# Altium schematic sheet Sch2.SchDoc
size A3; SheetNumber: 1; SheetTotal: 2
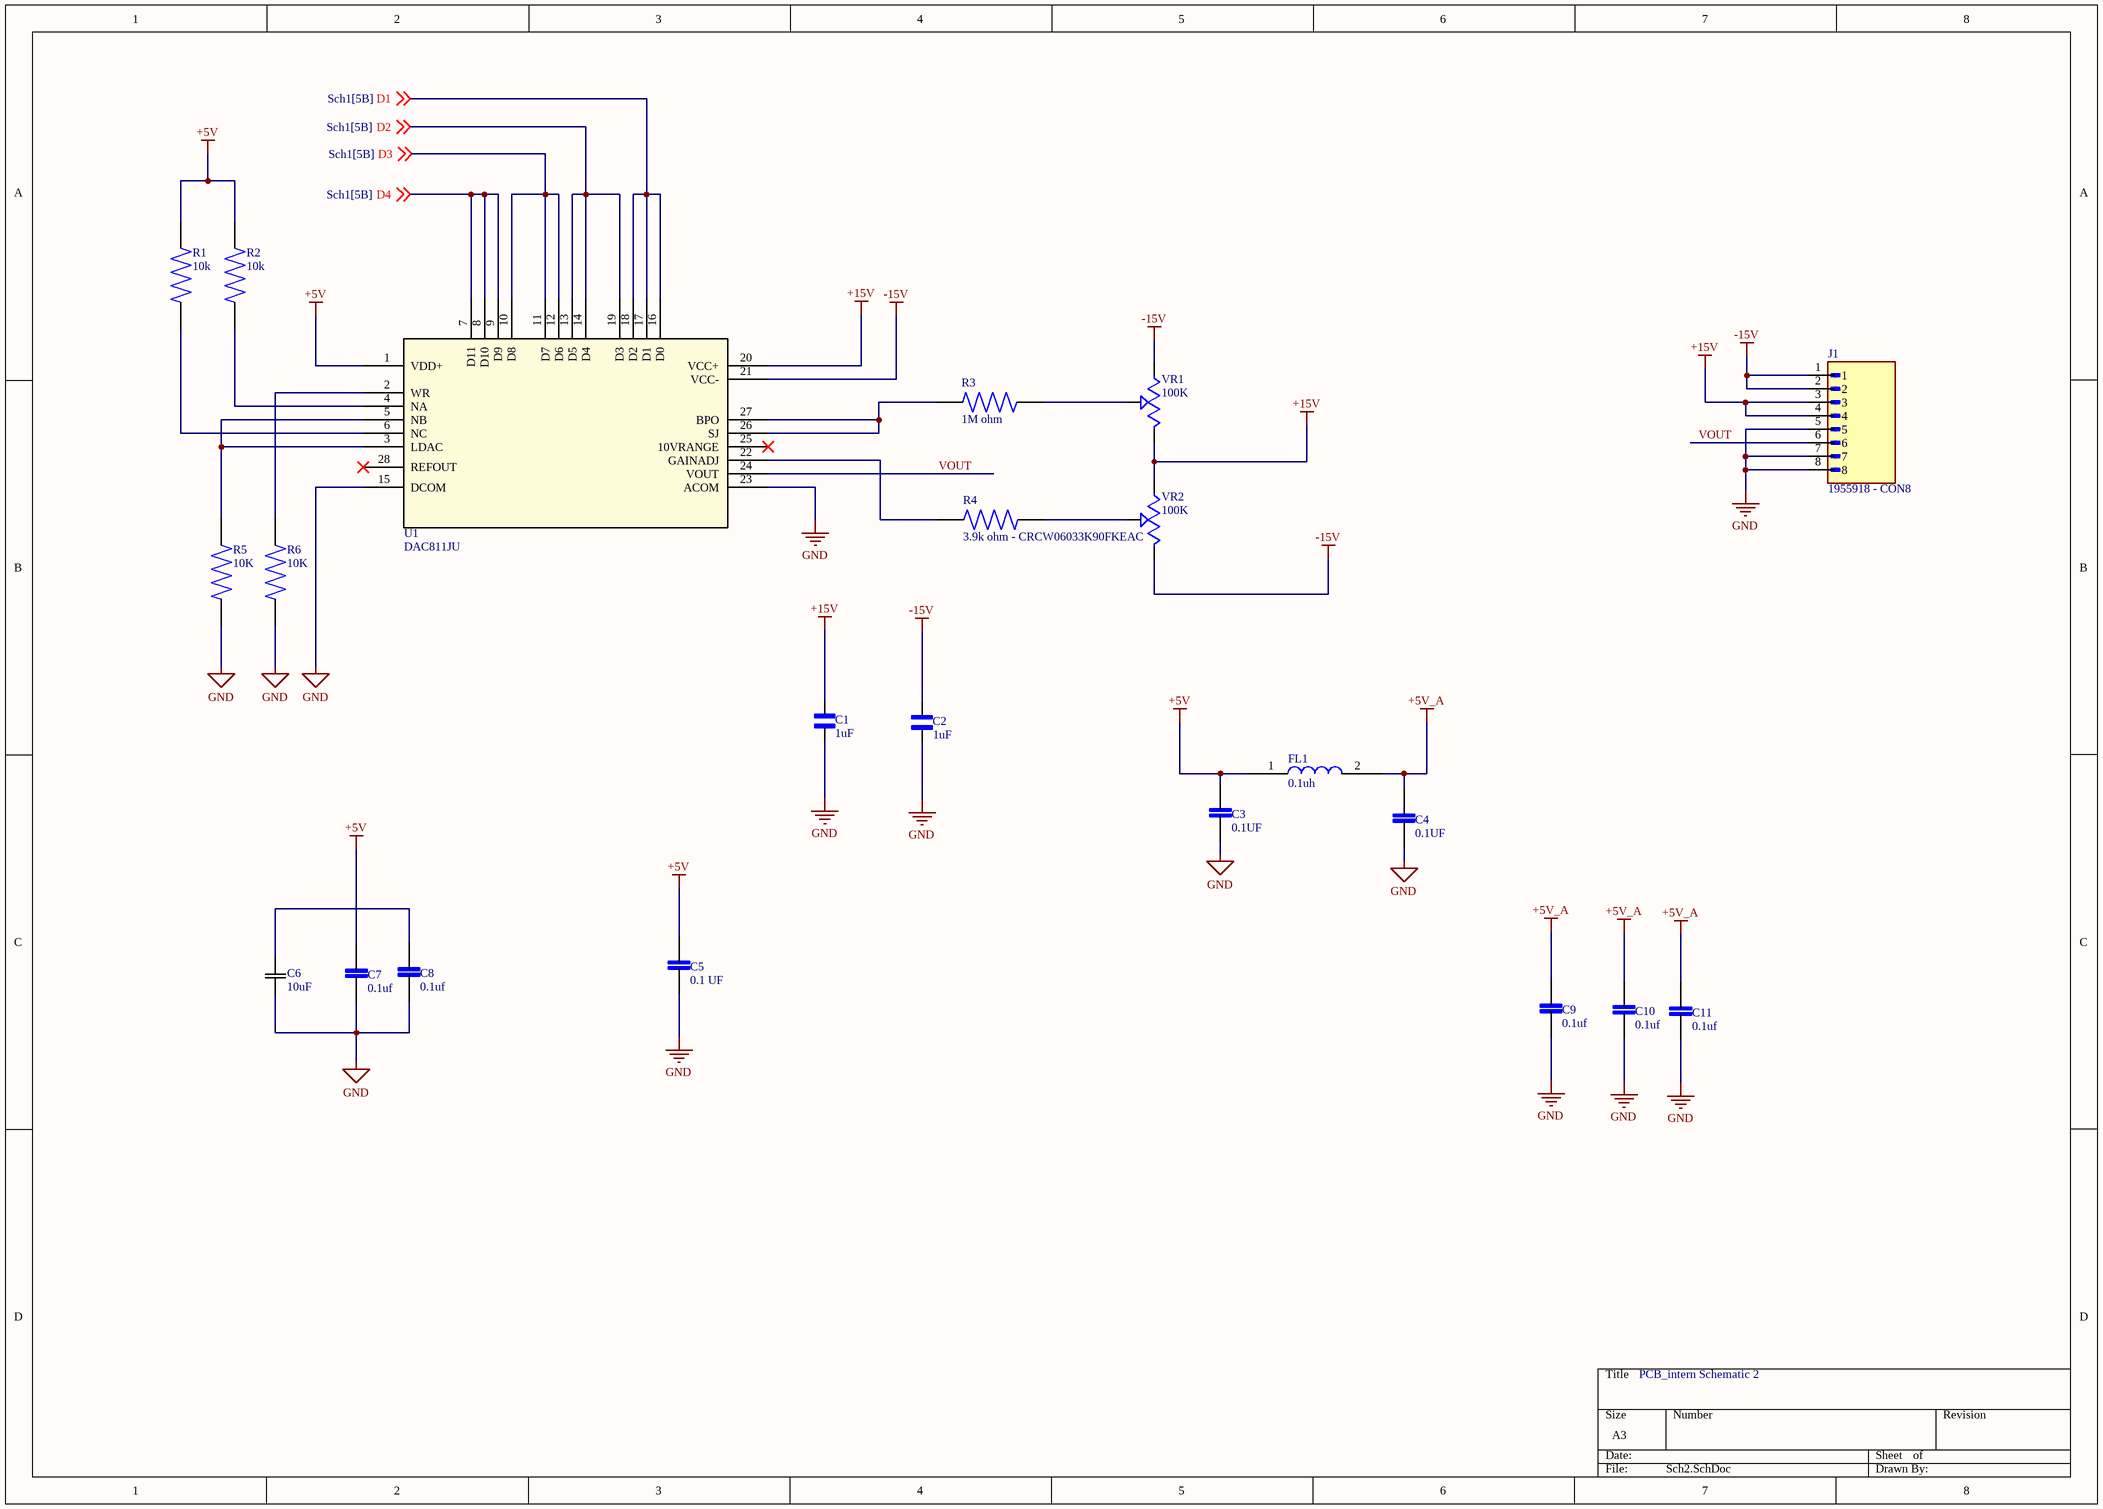
[diagram p0: Sch2.SchDoc]

## Parts
C1  1uF  [VARC3216X85N]
C2  1uF  [VARC3216X85N]
C3  0.1UF  [CAPC1608X90]
C4  0.1UF  [CAPC1608X90]
C5  0.1 UF  [CAPC1608X90]
C6  10uF  [CAP_TCJ-C-2312_KAV]
C7  0.1uf  [CAPC1608X90]
C8  0.1uf  [CAPC1608X90]
C9  0.1uf  [CAPC1608X90]
C10  0.1uf  [CAPC1608X90]
C11  0.1uf  [CAPC1608X90]
FL1  0.1uh  [BEADC1608X95N]
J1  1955918 - CON8  [PHOENIX_1955918]
R1  10k  [RESC1508X50N]
R2  10k  [RESC1508X50N]
R3  1M ohm  [RESC1508X50N]
R4  3.9k ohm - CRCW06033K90FKEAC  [RESC1608X55N]
R5  10K  [RESC1508X50N]
R6  10K  [RESC1508X50N]
U1  DAC811JU  [DW28]
VR1  100K  [TRIM_3266W-1-104LF]
VR2  100K  [TRIM_3266W-1-104LF]

## Nets
+5V: C3.2 C5.2 C7.2 FL1.1 R1.2 R2.2 U1.1(VDD+)
+5V_A: C4.2 C9.2 C10.2 C11.2 FL1.2
+15V: C1.1 J1.3 J1.4 U1.20(VCC+) VR1.3(CW) VR2.1(CCW)
-15V: C2.1 J1.1 J1.2 U1.21(VCC-) VR1.1(CCW) VR2.3(CW)
GND: C1.2 C2.2 C3.1 C4.1 C5.1 C6.1 C7.1 C8.1 C9.1 C10.1 C11.1 J1.5 J1.7 J1.8 R5.1 R6.1 U1.15(DCOM) U1.23(ACOM)
D1: U1.16(D0) U1.17(D1) U1.18(D2) ; off-sheet D1
D2: U1.13(D5) U1.14(D4) U1.19(D3) ; off-sheet D2
D3: U1.10(D8) U1.11(D7) U1.12(D6) ; off-sheet D3
D4: U1.7(D11) U1.8(D10) U1.9(D9) ; off-sheet D4
VOUT: J1.6 U1.24(VOUT)
NetC6_2: C6.2 C8.2
NetR1_1: R1.1 U1.6(NC)
NetR2_1: R2.1 U1.4(NA)
NetR3_1: R3.1 U1.26(SJ) U1.27(BPO)
NetR3_2: R3.2 VR1.2(WIPER)
NetR4_1: R4.1 U1.22(GAINADJ)
NetR4_2: R4.2 VR2.2(WIPER)
NetR5_2: R5.2 U1.3(LDAC) U1.5(NB)
NetR6_2: R6.2 U1.2(WR)

Not connected (* = marked no-connect by the designer): U1 25(10VRANGE)* 28(REFOUT)*

## Notes on the sheet
- PCB_intern Schematic 2

## Library data of the parts
C1 C2 = 1uF - C1206C104K5RACTU: Capacitor;Ceramic;Cap;.1 uF;Tol+10%;SMT;Vol-Rtg 50V;X7R;TR | KEMET C1206C104K5RACTU; SnapEDA_Link: https://www.snapeda.com/parts/C1206C104K5RACTU/KEMET/view-part/?ref=snap; Package: 1206-2 KEMET; Value: *; MF: KEMET; MP: C1206C104K5RACTU; Check_prices: https://www.snapeda.com/parts/C1206C104K5RACTU/KEMET/view-part/?ref=eda
C3-C5 C7-C11 = 0.1uf - C0603C104K5RACTU: 0.1 ÂµF Â±10% 50V Ceramic Capacitor X7R 0603 (1608 Metric); MF: KEMET; SnapEDA_Link: https://www.snapeda.com/parts/C0603C104K5RACTU/KEMET/view-part/?ref=snap; Package: 603-2 KEMET; Value: *; MP: C0603C104K5RACTU; Check_prices: https://www.snapeda.com/parts/C0603C104K5RACTU/KEMET/view-part/?ref=eda
C6 = 10UF - TCJC106M035R0200E: Description; Manufacturer_Name: KYOCERA AVX; Type: Tantalum-Polymer Capacitors; Copyright: Copyright (C) 2025 Ultra Librarian. All rights reserved.; Manufacturer_Part_Number: TCJC106M035R0200E
FL1 = 0.1uh-BLM18AG601SN1D: 0.1uHz 1 - Ferrite Bead 0603 (1608 Metric) 500mA 380mOhm; MF: Murata; Check_prices: https://www.snapeda.com/parts/BLM18AG601SN1D/Murata/view-part/?ref=eda; SnapEDA_Link: https://www.snapeda.com/parts/BLM18AG601SN1D/Murata/view-part/?ref=snap; Availability: In Stock; Value: *; Price: None; MP: BLM18AG601SN1D; Package: 1608 Murata; Purchase-URL: https://pricing.snapeda.com/search/part/BLM18AG601SN1D/?ref=eda
R1 R2 R5 R6 = 10k ohm - CRCW060310K0FKEA: 10 kOhms Â±1% 0.333W, 1/3W Chip Resistor 0603 (1608 Metric) Automotive AEC-Q200, Pulse Withstanding Thick Film; MF: Vishay; Purchase-URL: https://pricing.snapeda.com/search?q=CRCW060310K0FKEA&ref=eda; Package: 1508 Vishay; Check_prices: https://www.snapeda.com/parts/CRCW060310K0FKEA/Vishay+Dale/view-part/?ref=eda; Value: *; SnapEDA_Link: https://www.snapeda.com/parts/CRCW060310K0FKEA/Vishay+Dale/view-part/?ref=snap; MP: CRCW060310K0FKEA
R3 = 1MHz - CRCW06031M00FKEA: Resistor, Thick Film, 1 Megohms, 0.1 W, 1%, SMT, 0603, TCR 37 ppm/DegC, Cut Tape | Vishay Dale CRCW06031M00FKEA; SnapEDA_Link: https://www.snapeda.com/parts/CRCW06031M00FKEA/Vishay+Dale/view-part/?ref=snap; Package: 1508 Vishay; Value: *; MF: Vishay; MP: CRCW06031M00FKEA; Check_prices: https://www.snapeda.com/parts/CRCW06031M00FKEA/Vishay+Dale/view-part/?ref=eda
U1 = U3 - DAC811JU: 12-bit Digital-to-Analog Converter w/Parallel Interface 28-SOIC 0 to 70; Manufacturer_Name: Texas Instruments; Copyright: Copyright (C) 2026 Ultra Librarian. All rights reserved.; Manufacturer_Part_Number: DAC811JU; Datasheet: https://www.ti.com/lit/gpn/dac811; RefDes: RefDes; Type: Type
VR1 VR2 = 100K variable res - 3266W-1-104LF: 100 kOhms 0.25W, 1/4W PC Pins Through Hole Trimmer Potentiometer Cermet 12 Turn Top Adjustment; MF: Bourns; MP: 3266W-1-104LF; Price: None; Package: TO-218 Bourns; Check_prices: https://www.snapeda.com/parts/3266W-1-104LF/Bourns/view-part/378417/?ref=eda; Value: *; Availability: In Stock; SnapEDA_Link: https://www.snapeda.com/parts/3266W-1-104LF/Bourns/view-part/378417/?ref=snap
J1 = 1955918 - CON8: Package: None; Price: None; Value: *; MP: 1955918; Availability: Unavailable
R4 = 3.9k ohm - CRCW06033K90FKEAC: Package: None; Price: None; Value: *; MP: CRCW06033K90FKEAC; Availability: Unavailable